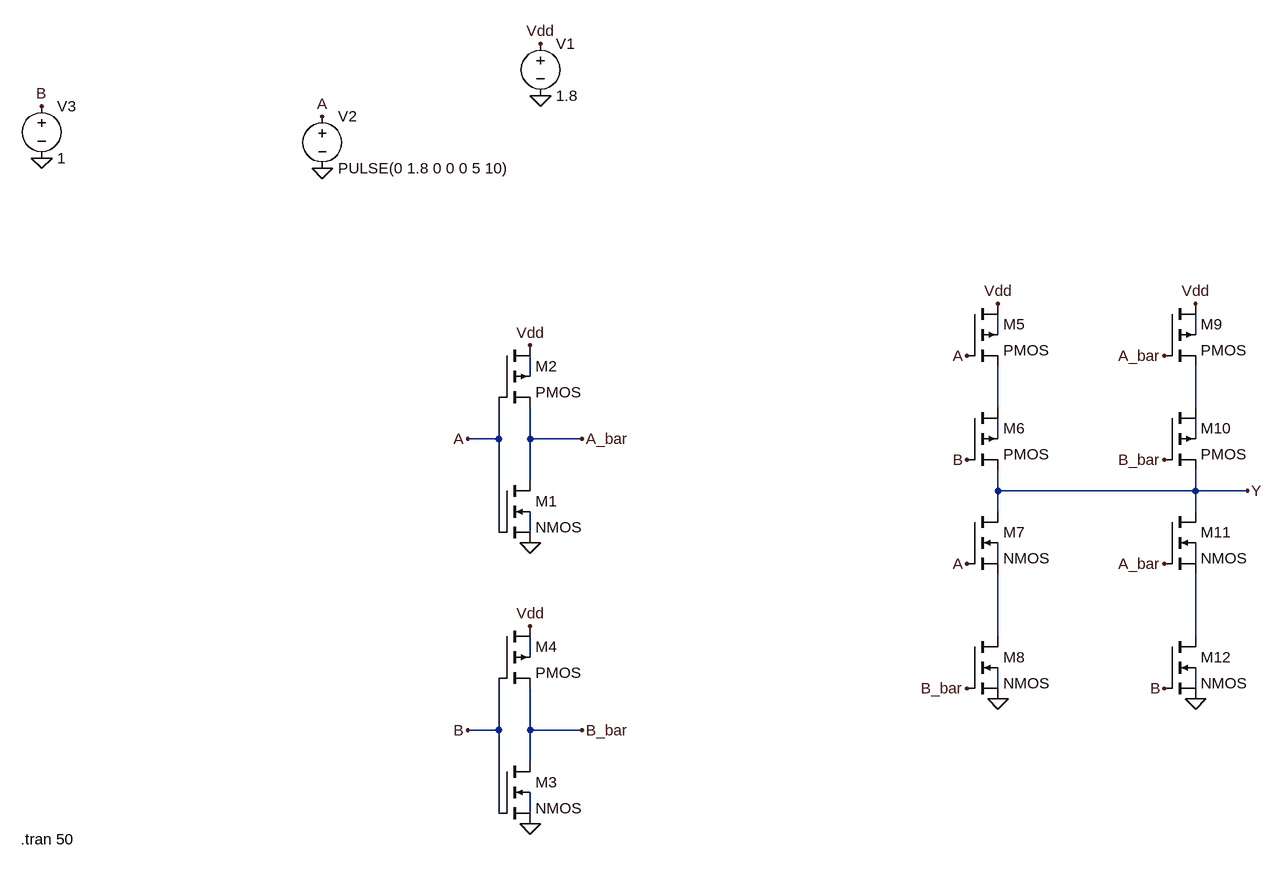
[diagram p0: schematic XNOR.asc]
XNOR.asc, the LTspice schematic file:
Version 4
SHEET 1 1440 984
WIRE 1024 192 1024 160
WIRE 1328 192 1328 160
WIRE 304 256 304 224
WIRE 1024 304 1024 240
WIRE 1328 304 1328 240
WIRE 256 352 256 288
WIRE 256 352 208 352
WIRE 304 352 304 304
WIRE 384 352 304 352
WIRE 1024 352 1024 320
WIRE 1328 352 1328 320
WIRE 304 416 304 352
WIRE 1024 432 1024 400
WIRE 1328 432 1328 400
WIRE 1328 432 1024 432
WIRE 1408 432 1328 432
WIRE 1024 464 1024 432
WIRE 1328 464 1328 432
WIRE 256 496 256 352
WIRE 304 496 304 464
WIRE 1024 544 1024 512
WIRE 1328 544 1328 512
WIRE 1024 656 1024 560
WIRE 1328 656 1328 560
WIRE 304 688 304 656
WIRE 1024 736 1024 704
WIRE 1328 736 1328 704
WIRE 256 800 256 720
WIRE 256 800 208 800
WIRE 304 800 304 736
WIRE 384 800 304 800
WIRE 304 848 304 800
WIRE 256 928 256 800
WIRE 304 928 304 896
FLAG 320 -256 Vdd
FLAG 320 -176 0
FLAG -16 -144 A
FLAG -16 -64 0
FLAG -448 -160 B
FLAG -448 -80 0
FLAG 304 512 0
FLAG 304 208 Vdd
FLAG 384 352 A_bar
FLAG 208 352 A
FLAG 304 944 0
FLAG 304 640 Vdd
FLAG 208 800 B
FLAG 384 800 B_bar
FLAG 1024 144 Vdd
FLAG 1024 752 0
FLAG 1328 144 Vdd
FLAG 1328 752 0
FLAG 1408 432 Y
FLAG 976 224 A
FLAG 1280 224 A_bar
FLAG 1280 544 A_bar
FLAG 976 544 A
FLAG 976 736 B_bar
FLAG 976 384 B
FLAG 1280 736 B
FLAG 1280 384 B_bar
SYMBOL voltage 320 -272 R0
WINDOW 123 0 0 Left 0
WINDOW 39 0 0 Left 0
SYMATTR InstName V1
SYMATTR Value 1.8
SYMBOL voltage -16 -160 R0
WINDOW 123 0 0 Left 0
WINDOW 39 0 0 Left 0
SYMATTR InstName V2
SYMATTR Value PULSE(0 1.8 0 0 0 5 10)
SYMBOL voltage -448 -176 R0
WINDOW 123 0 0 Left 0
WINDOW 39 0 0 Left 0
SYMATTR InstName V3
SYMATTR Value 1
SYMBOL nmos4 256 416 R0
SYMATTR InstName M1
SYMATTR Value2 l=0.13u w=0.13u
SYMBOL pmos4 256 208 R0
SYMATTR InstName M2
SYMATTR Value2 l=0.13u w=0.13u
SYMBOL nmos4 256 848 R0
SYMATTR InstName M3
SYMATTR Value2 l=0.13u w=0.13u
SYMBOL pmos4 256 640 R0
SYMATTR InstName M4
SYMATTR Value2 l=0.13u w=0.13u
SYMBOL pmos4 976 144 R0
SYMATTR InstName M5
SYMATTR Value2 l=0.13u w=0.13u
SYMBOL pmos4 976 304 R0
SYMATTR InstName M6
SYMATTR Value2 l=0.13u w=0.13u
SYMBOL nmos4 976 464 R0
SYMATTR InstName M7
SYMATTR Value2 l=0.13u w=0.13u
SYMBOL nmos4 976 656 R0
SYMATTR InstName M8
SYMATTR Value2 l=0.13u w=0.13u
SYMBOL pmos4 1280 144 R0
SYMATTR InstName M9
SYMATTR Value2 l=0.13u w=0.13u
SYMBOL pmos4 1280 304 R0
SYMATTR InstName M10
SYMATTR Value2 l=0.13u w=0.13u
SYMBOL nmos4 1280 464 R0
SYMATTR InstName M11
SYMATTR Value2 l=0.13u w=0.13u
SYMBOL nmos4 1280 656 R0
SYMATTR InstName M12
SYMATTR Value2 l=0.13u w=0.13u
TEXT -480 968 Left 2 !.tran 50

The netlist it stands for:
* XNOR.asc
V1 Vdd 0 1.8
V2 A 0 PULSE(0 1.8 0 0 0 5 10)
V3 B 0 1
M1 A_bar A 0 N008 NMOS l=0.13u w=0.13u
M2 Vdd A A_bar N003 PMOS l=0.13u w=0.13u
M3 B_bar B 0 N016 NMOS l=0.13u w=0.13u
M4 Vdd B B_bar N013 PMOS l=0.13u w=0.13u
M5 Vdd A N004 N001 PMOS l=0.13u w=0.13u
M6 N004 B Y N006 PMOS l=0.13u w=0.13u
M7 Y A N011 N009 NMOS l=0.13u w=0.13u
M8 N011 B_bar 0 N014 NMOS l=0.13u w=0.13u
M9 Vdd A_bar N005 N002 PMOS l=0.13u w=0.13u
M10 N005 B_bar Y N007 PMOS l=0.13u w=0.13u
M11 Y A_bar N012 N010 NMOS l=0.13u w=0.13u
M12 N012 B 0 N015 NMOS l=0.13u w=0.13u
.model NMOS NMOS
.model PMOS PMOS
.lib standard.mos
.tran 50
.backanno
.end